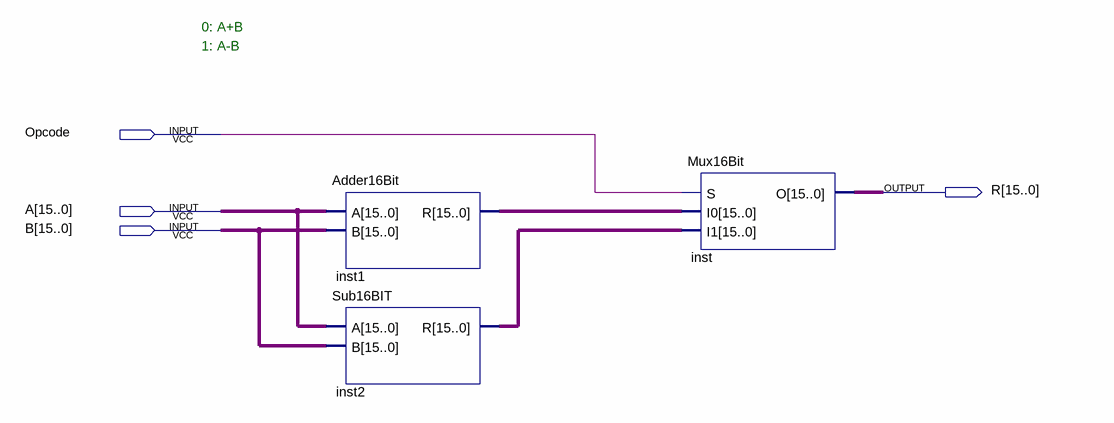
[diagram p0: schematic sheet]
// Quartus schematic AddSub16Bit.bdf as structural Verilog: 3 symbols, 4 pins
module AddSub16Bit (
  input  Opcode,
  input  [15:0] A,
  input  [15:0] B,
  output [15:0] R
);

  wire [15:0] inst1_r, inst2_r;

  Adder16Bit inst1 (.A(A), .B(B), .R(inst1_r));
  Sub16BIT inst2 (.A(A), .B(B), .R(inst2_r));
  Mux16Bit inst (.S(Opcode), .I0(inst1_r), .I1(inst2_r), .O(R));

  // Notes on the sheet:
  //   0: A+B
  //   1: A-B
endmodule
